# Altium schematic sheet BMP280.SchDoc: Onboard Pressure/Temperature Sensor
size Tabloid; Author: Set in Document Options » Parameters » Author + Contact info
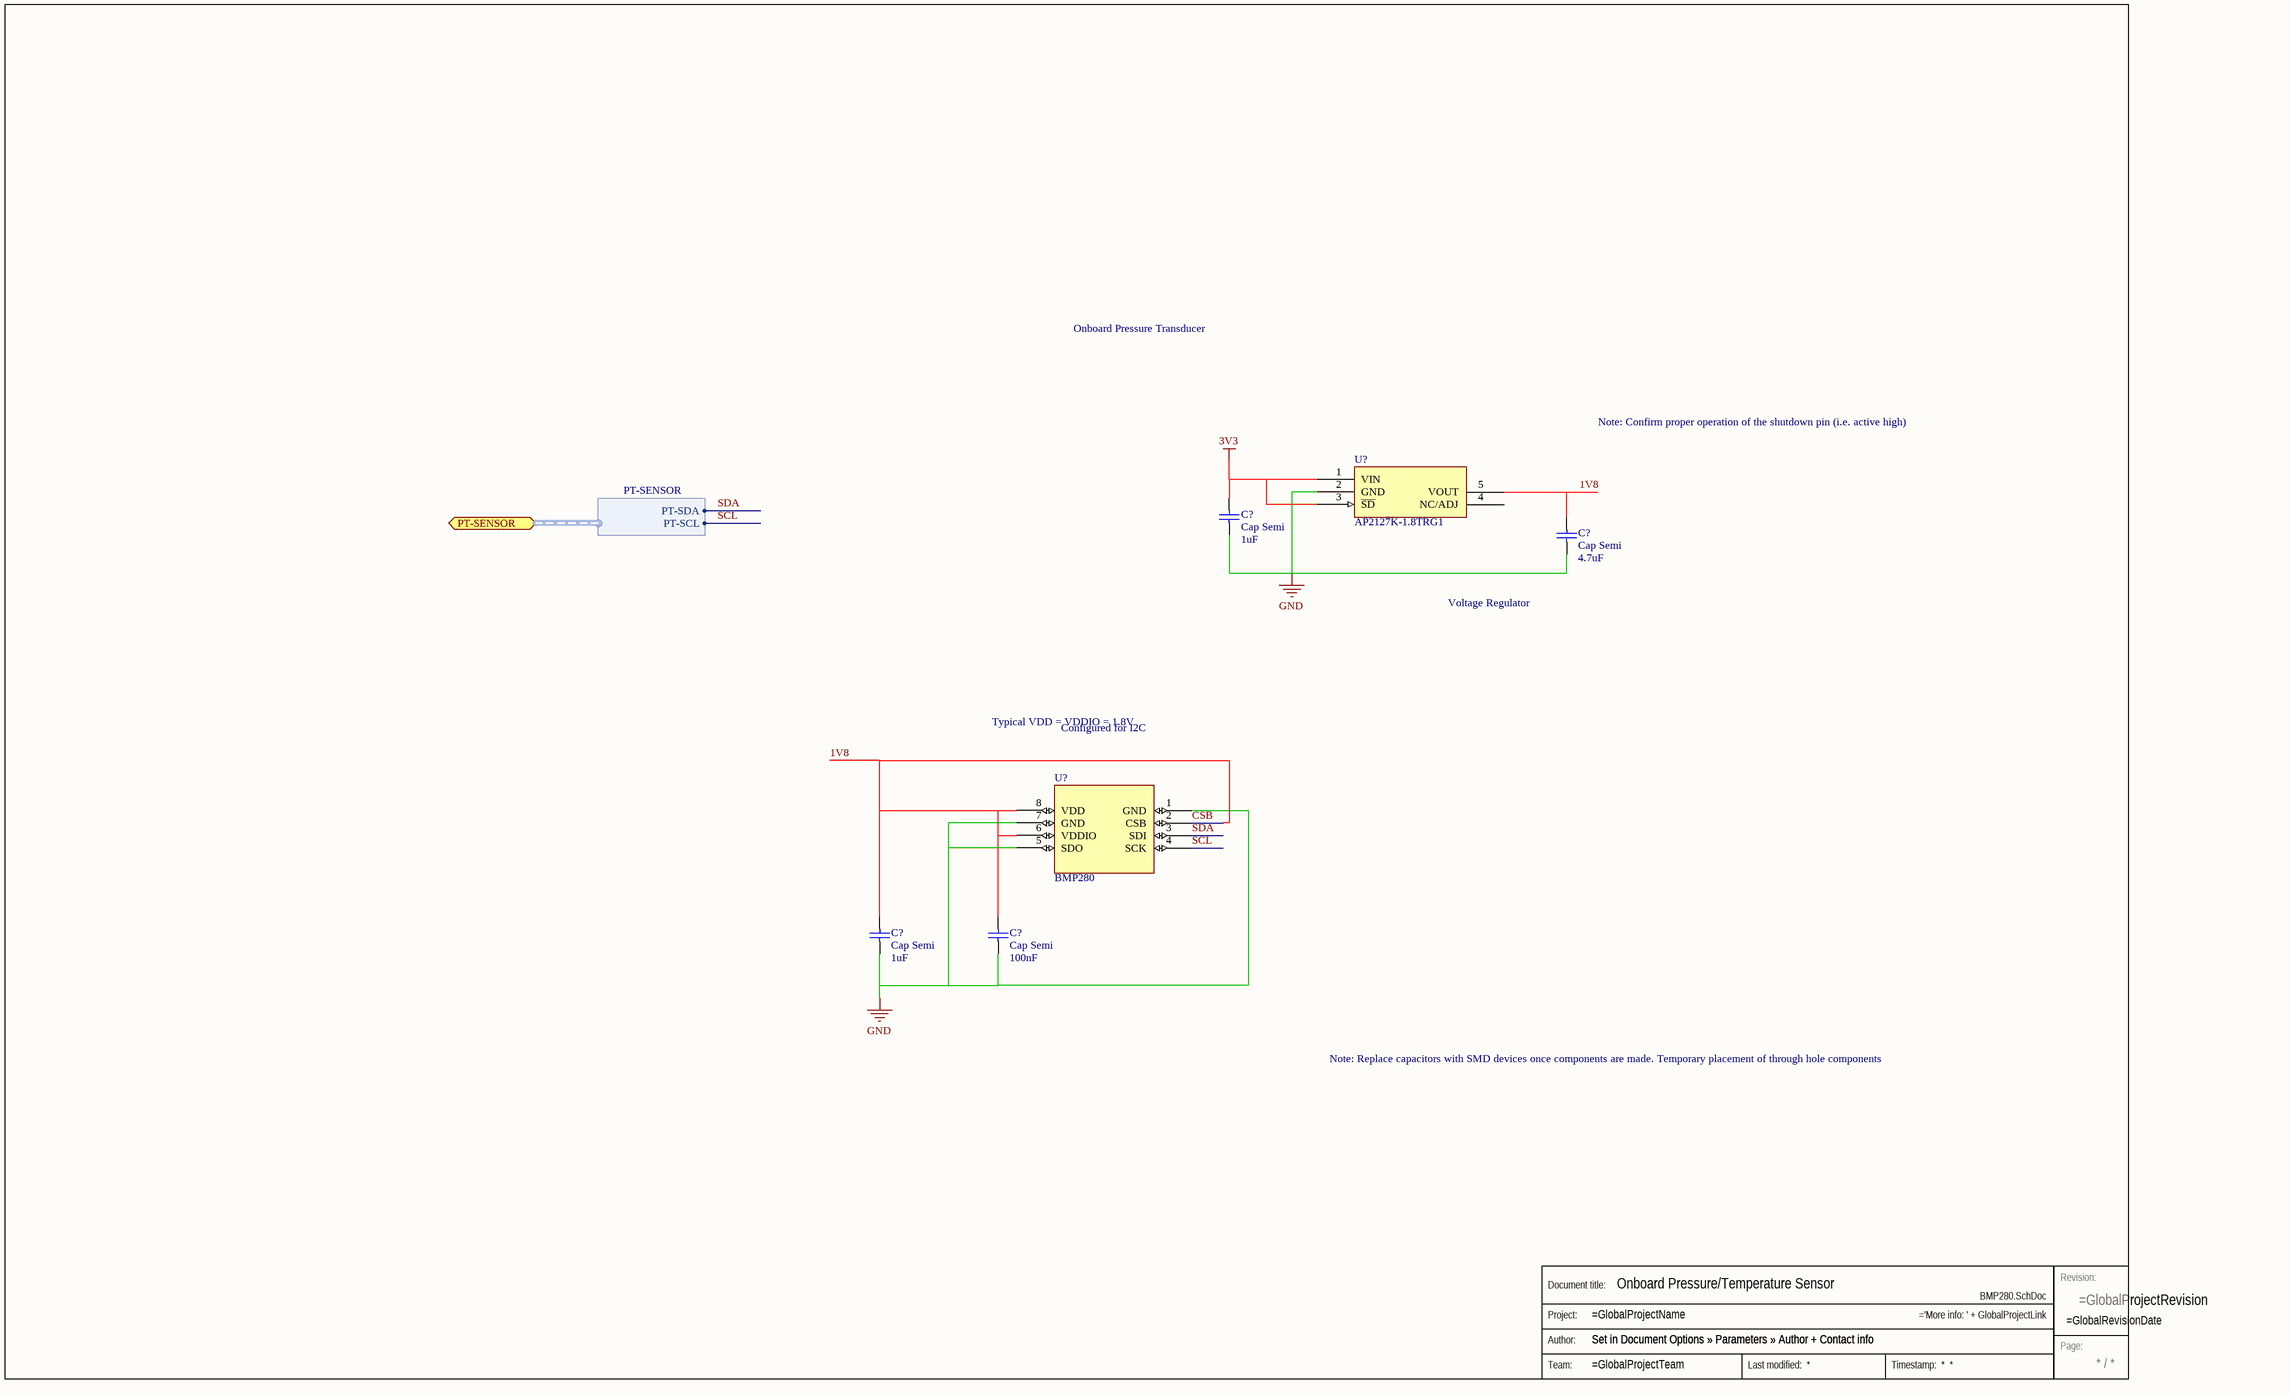
[diagram p0: BMP280.SchDoc]

## Parts
(Parts that share a designator on the sheet are numbered #1, #2 ... from top to bottom, then left to right.)
C?#1  Cap Semi  value 1uF  [0402]
C?#2  Cap Semi  value 4.7uF  [0402]
C?#3  Cap Semi  value 1uF  [0402]
C?#4  Cap Semi  value 100nF  [0402]
Stamp  Stamp  (value not drawn)  (graphical)
U?#1  AP2127  [SOT95P240X110-3N]  (value not drawn)
U?#2  BMP280  [LGA-8_BMP280(Primary)]

## Ports
PT-SENSOR (harness PT-SENSOR)

## Harnesses
PT-SENSOR: PT-SCL, PT-SDA

## Nets
CSB: U?#2.2(CSB)
SCL: U?#2.4(SCK) ; port PT-SENSOR.PT-SCL
SDA: U?#2.3(SDI) ; port PT-SENSOR.PT-SDA

Not connected (* = marked no-connect by the designer): C?#1 1 2; C?#2 1 2; C?#3 1 2; C?#4 1 2; U?#1 1(VIN) 2(GND) 3(~{SD}) 4(NC/ADJ) 5(VOUT); U?#2 1(GND) 5(SDO) 6(VDDIO) 7(GND) 8(VDD)

## Buses and harness runs
bus 1V8

## Notes on the sheet
- Onboard Pressure Transducer
- Note: Confirm proper operation of the shutdown pin (i.e. active high)
- Voltage Regulator
- Typical VDD = VDDIO = 1.8V
- Configured for I2C
- Note: Replace capacitors with SMD devices once components are made. Temporary placement of through hole components
- Labels drawn without touching a wire or pin: 3V3, GND
- (in symbol Stamp) Revision:; Document title:; Project:; Author:; Page:; Team:

## Library data of the parts
C?#1-C?#4 = Cap Semi: Capacitor (Semiconductor SIM Model); Published: 8-Jun-2000; LatestRevisionDate: 29-May-2009; LatestRevisionNote: IPC-7351 Footprint Added.; PackageReference: C1206; Publisher: Altium Limited; PackageDescription: Chip Capacitor
U?#1 = AP2127: AP2127K-1.8TRG1; Manufacturer: Diodes Incorporated; Digikey Link: https://www.digikey.com/product-detail/en/diodes-incorporated/AP2127K-1.8TRG1/AP2127K-1.8TRG1DICT-ND/4505274; Digikey P/N: AP2127K-1.8TRG1DICT-ND; Footprint: SOT-23-5; Manufacturer P/N: AP2127K-1.8TRG1
U?#2 = BMP280: BMP280 Absolute Barometric Pressure Sensor for Battery Powered Devices 2 x 2.5mm; MF: Bosch; Availability: Good; MP: BMP280; Price: 2.16 USD; Package: None; Value: *